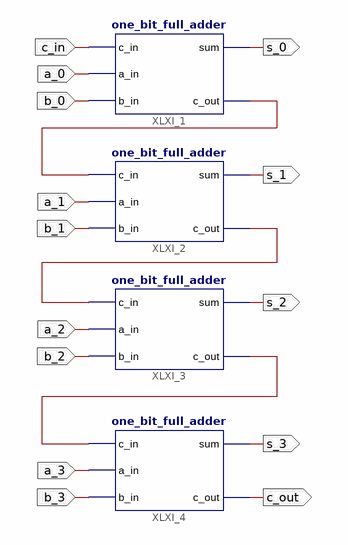
[diagram p0: schematic sheet 1]
// Xilinx ISE schematic four_bit_ripple_carry_adder.sch (spartan3) as structural Verilog: 4 symbols, 14 ports
module four_bit_ripple_carry_adder (
  input  c_in,
  input  a_0,
  input  b_0,
  input  a_1,
  input  b_1,
  input  a_2,
  input  b_2,
  input  a_3,
  input  b_3,
  output s_0,
  output s_1,
  output s_2,
  output s_3,
  output c_out
);

  wire XLXN_2, XLXN_6, XLXN_8;

  one_bit_full_adder XLXI_1 (.c_in(c_in), .a_in(a_0), .b_in(b_0), .sum(s_0), .c_out(XLXN_8));
  one_bit_full_adder XLXI_2 (.c_in(XLXN_8), .a_in(a_1), .b_in(b_1), .sum(s_1), .c_out(XLXN_6));
  one_bit_full_adder XLXI_3 (.c_in(XLXN_6), .a_in(a_2), .b_in(b_2), .sum(s_2), .c_out(XLXN_2));
  one_bit_full_adder XLXI_4 (.c_in(XLXN_2), .a_in(a_3), .b_in(b_3), .sum(s_3), .c_out(c_out));
endmodule
